# Altium schematic sheet Power_Meter.SchDoc: Power Meter
size A4; Author: Joe Dai; DrawnBy: Joe Dai; SheetNumber: 1; SheetTotal: 1; SPICEModelCacheBZHZIPIH: <root> / <DocumentId>BZHZIPIH</DocumentId> / </root>
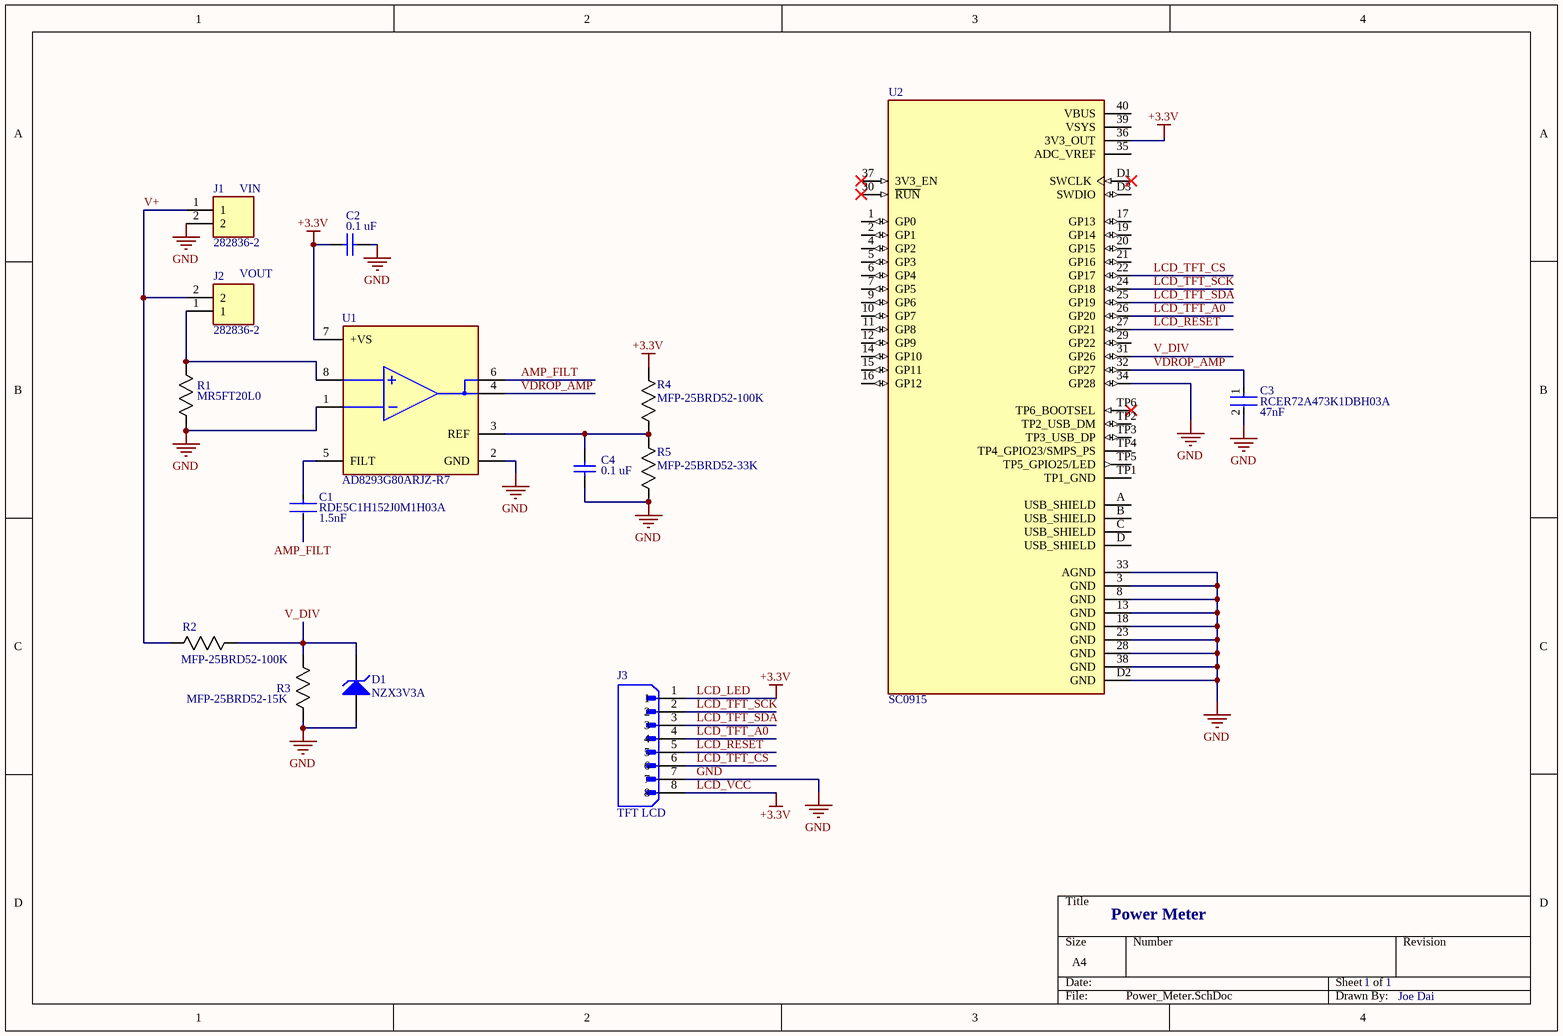
[diagram p0: Power_Meter.SchDoc]

## Parts
C1  RDE5C1H152J0M1H03A  Capacitance: 1.5nF  [FP-RDE0M1-MFG]
C2  Capacitance: 0.1 uF  [CAPC3216X95X55NL15T25]  (hidden comment: GRM319R71H104KA01D)
C3  RCER72A473K1DBH03A  Capacitance: 47nF  [FP-RCE1A2-MFG]
C4  Capacitance: 0.1 uF  [CAPC3216X95X55NL15T25]  (hidden comment: GRM319R71H104KA01D)
D1  NZX3V3A  [DIOAD820W60L400D200]
J1  282836-2  [TE_282836-2]
J2  282836-2  [TE_282836-2]
J3  TFT LCD  [AMPHENOL_G800LE300018YEU]
R1  MR5FT20L0  [STA_MR5_STP]
R2  MFP-25BRD52-100K  [YAG_MF25_YAG]
R3  MFP-25BRD52-15K  [YAG_MF25_YAG]
R4  MFP-25BRD52-100K  [YAG_MF25_YAG]
R5  MFP-25BRD52-33K  [YAG_MF25_YAG]
U1  AD8293G80ARJZ-R7  [FP-RJ-8-IPC_B]
U2  SC0915  [MODULE_SC0915]

## Nets
GND: C2.1 C4.2 D1.1(A) J1.2 J3.7 R1.2 R3.1 R5.2 U1.1(-IN) U1.2(GND) U2.3(GND) U2.8(GND) U2.13(GND) U2.18(GND) U2.23(GND) U2.28(GND) U2.33(AGND) U2.34(GP28) U2.38(GND) U2.D2(GND)
LCD_LED: C2.2 J3.1 J3.8 R4.1 U1.7(+VS) U2.36(3V3_OUT)  [also labelled +3.3V, LCD_VCC]
AMP_FILT: C1.2 U1.6(OUT)
LCD_RESET: J3.5 U2.27(GP21)
LCD_TFT_A0: J3.4 U2.26(GP20)
LCD_TFT_CS: J3.6 U2.22(GP17)
LCD_TFT_SCK: J3.2 U2.24(GP18)
LCD_TFT_SDA: J3.3 U2.25(GP19)
V+: J1.1 J2.2 R2.1
V_DIV: D1.2(K) R2.2 R3.2 U2.31(GP26)
VDROP_AMP: C3.1 U1.4(ADC_OUT) U2.32(GP27)
NetC1_1: C1.1 U1.5(FILT)
NetC4_1: C4.1 R4.2 R5.1 U1.3(REF)
NetJ2_1: J2.1 R1.1 U1.8(+IN)

Not connected (* = marked no-connect by the designer): C3 2; U2 1(GP0) 2(GP1) 4(GP2) 5(GP3) 6(GP4) 7(GP5) 9(GP6) 10(GP7) 11(GP8) 12(GP9) 14(GP10) 15(GP11) 16(GP12) 17(GP13) 19(GP14) 20(GP15) 21(GP16) 29(GP22) 30(~{RUN})* 35(ADC_VREF) 37(3V3_EN)* 39(VSYS) 40(VBUS) A(USB_SHIELD) B(USB_SHIELD) C(USB_SHIELD) D(USB_SHIELD) D1(SWCLK)* D3(SWDIO) TP1(TP1_GND) TP2(TP2_USB_DM) TP3(TP3_USB_DP) TP4(TP4_GPIO23/SMPS_PS) TP5(TP5_GPIO25/LED) TP6(TP6_BOOTSEL)*

## Notes on the sheet
- (near J1) VIN
- (near J2) VOUT
- Power Meter
- 1
- Joe Dai

## Library data of the parts
C1 = CMP-06035-053070-1: Ceramic Capacitor 1.5nF ±5% 50V C0G Radial; Lead/Base Style: Formed Leads; Lead Diameter: 0.5mm; Lead Pitch: 0.197inch; Height - Seated (Max): 0.236inch; Resistor Type: Ceramic; Max Operating Temperature: 125°C; Mount: Through Hole; Voltage Rating (DC): 50V; Packaging: Tape and Reel; Length: 0.157inch; Case/Package: Radial; Termination: Radial; Width: 3.5mm; Dielectric: C0G; Tolerance: 5%; Voltage Rating: 50V; Height: 3.5mm; Package Quantity: 2000; Min Operating Temperature: -55°C
C2 C4 = CMP-1662-00007-4: Chip Capacitor, 0.1 uF, +/- 10%, 50 V, -55 to 125 degC, 1206 (3216 Metric), RoHS, Tape and Reel; Manufacturer: Murata; Voltage Rating: 50 V; Lead Pitch: 4 mm; PackageDescription: 2-Pin Surface Mount Device, Body 3.2 x 1.6 mm; DatasheetVersion: 03/2016; Min Operating Temperature: -55 degC; Package Quantity: 4000; RoHSCompliant: true; Max Operating Temperature: 125 degC; Height: 0.85 mm; Pins: 2; Length: 3.2 mm; PackageReference: 1206 (3216 Metric); Mounting Technology: Surface Mount; ComponentLink1Description: Manufacturer URL; ComponentLink2Description: Datasheet; ComponentLink1URL: http://www.murata.com/; Mount: Surface Mount; REACH SVHC: No SVHC; Packaging: Tape and Reel; ComponentLink2URL: http://search.murata.co.jp/Ceramy/image/img/A01X/G101/ENG/GRM319R71H104KA01-01.pdf
C3 = CMP-06035-043805-1: Cap Ceramic 47nF 100V X7R ±10% Radial 2.5mm +125°C Automotive Ammo Pack; Lead/Base Style: Straight; Lead Diameter: 0.5mm; Tolerance: 10%; Voltage Rating (DC): 100V; Lead Pitch: 0.098inch; Dielectric: X7R; Ratings: AEC-Q200; Packaging: Tape and Reel; Resistor Type: Ceramic; Mount: Through Hole; Height - Seated (Max): 0.138inch; Termination: Radial; Voltage Rating: 100V; Min Operating Temperature: -55°C; Width: 0.098inch; Height: 3.5mm; Max Operating Temperature: 125°C; Length: 0.157inch; Package Quantity: 2000; Case/Package: Radial
D1 = D Zener: Zener Diode; Published: 8-Jun-2000; LatestRevisionDate: 17-Jul-2002; LatestRevisionNote: Re-released for DXP Platform.; PackageReference: DIODE-0.7; Publisher: Altium Limited; PackageDescription: Diode, Thru-Hole; 2 Leads; 0.7 in Pin Spacing
J1 J2 = 282836-2: Connector, Terminal Block; Wire Receptacle; 2 Pos.; 16-30 AWG; 0.197 in. CL; Sid; Manufacturer: TE Connectivity; MF: {'manufacturer': u'TE Connectivity'}; Plating: Brass; Number of Positions: 2; Number of Levels: 1; Current: 13.5A; Voltage: 300V; Interlock: Yes (With); Screw Flange: No (Without); Wire Gauge (Max): 30AWG; Pitch: 5mm; Thread Size: M3; Tail Length: 3.5mm; Approvals: UL; Package: None; Value: *; MP: 282836-2; Availability: Unavailable; Price: None; Supplier 1: Digi-Key; Manufacturer Part Number: 282836-2; RoHS: Yes; Category: Terminal Blocks; Stock 1: 3928; Pricing 1: 1=1.05000, 10=0.65800, 25=0.56320, 50=0.50620, 100=0.49560, 250=0.42180, 500=0.40070, 1000=0.35853, 5000=0.28049 (USD); Mounting Technology: Through Hole; Contact Material: Brass; Contact Plating: Tin; Color: Green; Housing Color: Green; Housing Material: Polyamide; Insulation Material: Nylon; Package Quantity: 300; Number of Rows: 1; Termination: Solder; Series: Buchanan; Packaging: Tray; Number of Positions Per Level: 2; Number of Contacts: 2; Number of Circuits: 2; Connector Type: Receptacle; Orientation: Straight; Screwless Terminal Block: No (Without); Side Stackable: Yes (With); Current Rating: 13.5A; Voltage Rating: 300V; Closed End: No (Without); Max Voltage Rating (AC): 300V; Number of Poles: 2; Max Supply Voltage (AC): 300V; Max Current Rating: 13.5A; Length: 10.6mm; Width: 10mm; Wire Gauge (Min): 30AWG; Wire/Cable Gauge: 30AWG; Depth: 8.2mm; Radiation Hardening: No; Flammability Rating: UL94 V-0; RoHS Compliant: Yes; ELV: Compliant; Lead Free: Lead Free; ComponentLink1URL: https://datasheet.ciiva.com/11757/0900766b8002dc8a-11757385.pdf?src-supplier=RSComponents; ComponentLink1Description: https://datasheet.ciiva.com/11757/0900766b8002dc8a-11757385.pdf?src-supplier=RSComponents; ComponentLink2URL: https://datasheet.ciiva.com/16393/282836-2-16393382.pdf?src-supplier=Future+Electronics; ComponentLink2Description: https://datasheet.ciiva.com/16393/282836-2-16393382.pdf?src-supplier=Future+Electronics; ComponentLink3URL: https://datasheet.ciiva.com/15169/getdatasheetpartid-155855-15169553.pdf?src-supplier=Verical; ComponentLink3Description: https://datasheet.ciiva.com/15169/getdatasheetpartid-155855-15169553.pdf?src-supplier=Verical; ComponentLink4URL: https://datasheet.ciiva.com/7628/1731782-7628513.pdf?src-supplier=Element14; ComponentLink4Description: https://datasheet.ciiva.com/7628/1731782-7628513.pdf?src-supplier=Element14; ComponentLink5URL: https://datasheet.ciiva.com/3141/eng-cs-1308389-eurostyle-terminal-blocks-0607-3141118.pdf?src-supplier=Avnet; ComponentLink5Description: https://datasheet.ciiva.com/3141/eng-cs-1308389-eurostyle-terminal-blocks-0607-3141118.pdf?src-supplier=Avnet; ComponentLink6URL: https://datasheet.ciiva.com/30261/eng-cs-1308389-eurostyle-terminal-blocks-0607-30261813.pdf?src-supplier=Onlinecomponents.com; ComponentLink6Description: https://datasheet.ciiva.com/30261/eng-cs-1308389-eurostyle-terminal-blocks-0607-30261813.pdf?src-supplier=Onlinecomponents.com; ComponentLink7URL: https://datasheet.ciiva.com/823/eng-cd-282836-h10-823437.pdf?src-supplier=Digi-Key; ComponentLink7Description: https://datasheet.ciiva.com/823/eng-cd-282836-h10-823437.pdf?src-supplier=Digi-Key
J3 = G800LE300018YEU: MF: {'manufacturer': u'Amphenol ICC (Commercial Products)'}; Availability: Unavailable; Package: None; MP: G800LE300018YEU; Value: *; Price: None
R1 = MR5FT20L0: No Description Available; Mfr_Name: Stackpole International; Copyright: Copyright (C) 2022 Ultra Librarian. All rights reserved.; Manufacturer_Part_Number: MR5FT20L0; Digi-Key_Part_Number_1: MR5FT20L0CT-ND; Digi-Key_Part_Number_2: MR5FT20L0TR-ND; RefDes: RefDes; Type: DEV
R2 R4 = MFP-25BRD52-100K: No Description Available; Mfr_Name: Yageo; Copyright: Copyright (C) 2022 Ultra Librarian. All rights reserved.; Manufacturer_Part_Number: MFP-25BRD52-100K; Digi-Key_Part_Number_1: 100KADCT-ND; Digi-Key_Part_Number_2: 100KADTR-ND; RefDes: RefDes; Type: DEV
R3 = MFP-25BRD52-15K: No Description Available; Mfr_Name: Yageo; Copyright: Copyright (C) 2022 Ultra Librarian. All rights reserved.; Manufacturer_Part_Number: MFP-25BRD52-15K; Digi-Key_Part_Number_1: 15KADCT-ND; Digi-Key_Part_Number_2: 15KADTR-ND; RefDes: RefDes; Type: DEV
R5 = MFP-25BRD52-33K: No Description Available; Mfr_Name: Yageo; Copyright: Copyright (C) 2022 Ultra Librarian. All rights reserved.; Manufacturer_Part_Number: MFP-25BRD52-33K; Digi-Key_Part_Number_1: 33KADCT-ND; Digi-Key_Part_Number_2: 33KADTR-ND; RefDes: RefDes; Type: DEV
U1 = CMP-09116-000180-1: IC INST AMP 1 CIRCUIT SOT23-8; Number of Elements: 1; -3db Bandwidth: 500Hz; Power Supply Rejection Ratio (PSRR): 94dB; Amplifier Type: INSTRUMENTATION AMPLIFIER; Input Bias Current: 2nA; Min Supply Voltage: 1.8V; Input Offset Voltage (Vos): 50uV; Output Current per Channel: 35mA; Common Mode Rejection Ratio: 140dB; Operating Supply Current: 1.3mA; Max Supply Voltage: 5.5V; Input Resistance: 10GR; Packaging: Tape and Reel; Gain Bandwidth Product: 500Hz; Min Operating Temperature: -40°C; Lead Free: Contains Lead; Number of Channels: 1; REACH SVHC: No SVHC; Series: -; Case/Package: SOT; Max Operating Temperature: 85°C; Contact Plating: Gold; Mount: Surface Mount; Number of Pins: 8; Package Quantity: 1; Number of Amplifiers: 1; Radiation Hardening: No; Number of Circuits: 1; RoHS Compliant: Yes
U2 = SC0915: Raspberry Pi Pico Embedded Dev Module; MF: {'manufacturer': u'Raspberry Pi'}; Package: None; Value: *; MP: SC0915; Availability: Unavailable; Price: None; Supplier 1: Digi-Key; Manufacturer: Raspberry Pi; Manufacturer Part Number: SC0915; RoHS: No; Category: Embedded Processors and Controllers; Stock 1: 26880; Pricing 1: 1=4.00000 (USD)